# EasyEDA Pro project ProPrj_CyMouse.epro, board 无线充电接收端
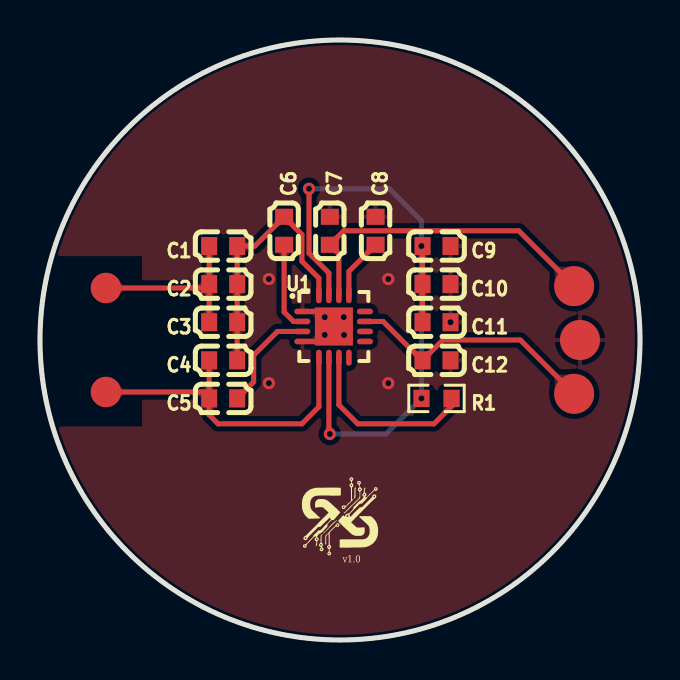
[diagram p5: board, top side]
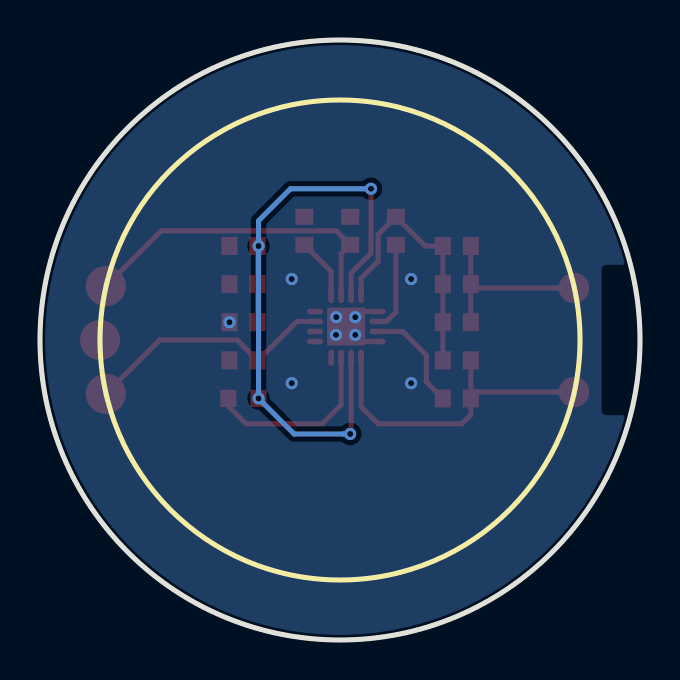
[diagram p6: board, bottom side, seen from below]

Outline 30 x 30 mm; copper layers: Top Layer, Bottom Layer. Coordinates in mm from the lower left corner of the outline.
Outline path: circle c15,15 r15
Stack: Top Layer 0.035mm / Dielectric1 1.51mm FR4 er 4.5 / Bottom Layer 0.035mm

## Design rules (mm)
template: JLCPCB Capability(Two Layers Board)
spacing copperThickness1oz (default): track to track 0.102, other pairs 0.152 to 0.3
spacing copperThickness2oz: track to track 0.203, other pairs 0.152 to 0.3
track width copperThickness1oz (default): min 0.127, default 0.254, max 2.54
track width copperThickness2oz: min 0.203, default 0.254, max 2.54
differential pair differentialPair (default): width min 0.127, default 0.254, max 2.54; gap min 0.152, default 0.152
via viaSize (default): diameter min 0.5, default 0.61, max 10; hole min 0.3, default 0.305, max 6.3

## Placement (name value [footprint] x y rotation side)
C1  10nF  [C0603]  9.16 19.7 180 top
C2  100nF  [C0603]  9.16 17.79 180 top
C3  22nF  [C0603]  9.16 15.89 180 top
C4  2.2nF  [C0603]  9.16 13.98 180 top
C5  47nF  [C0603]  9.16 12.08 180 top
C6  47nF  [C0603]  12.21 20.46 270 top
C7  4.7uF  [C0603]  14.49 20.46 90 top
C8  1uF  [C0603]  16.78 20.46 270 top
C9  10uF  [C0603]  19.83 19.7 180 top
C10  100nF  [C0603]  19.83 17.79 0 top
C11  10uF  [C0603]  19.83 15.89 180 top
C12  100nF  [C0603]  19.83 13.98 180 top
L1  -  [Test-Point-0.5mm#2]  3.3 17.6 0 top
L2  -  [Test-Point-0.5mm#2]  3.3 12.4 0 top
NOREF  -  [Pad_e63]  3.3 12.4 0 top
NOREF#2  -  [Pad_e62]  3.3 17.6 0 top
R1  220Ω  [R0603]  19.83 12.08 180 top
TP1  -  [Test-Point-0.5mm]  26.71 17.69 0 top
TP2  -  [Test-Point-0.5mm]  27 15 0 top
TP3  -  [Test-Point-0.5mm]  26.71 12.31 0 top
U1  NU1680  [QFN-16_L3.0-W3.0-P0.50-TL-EP1.9]  14.68 15.68 0 top

## Footprints (pads in the part's own frame, mm; a bottom-side part is the same pattern mirrored in y, then rotated)
C0603
  rect 0.8x0.9 smd: 1(-0.7,0) 2(0.7,0)
Pad_e62
  round 1.524 smd: 1(0,0)
Pad_e63
  round 1.524 smd: 2(0,0)
QFN-16_L3.0-W3.0-P0.50-TL-EP1.9
  oval 0.8x0.28 smd: 1(-1.565,0.749) 2(-1.565,0.249) 3(-1.565,-0.251) 4(-1.565,-0.751) 9(1.565,-0.751) 10(1.565,-0.251) 11(1.565,0.249) 12(1.565,0.749)
  oval 0.28x0.8 smd: 5(-0.739,-1.562) 6(-0.238,-1.562) 7(0.261,-1.562) 8(0.761,-1.562) 13(0.761,1.562) 14(0.261,1.562) 15(-0.238,1.562) 16(-0.739,1.562)
  rect 1.9x1.9 smd: 17(0.011,-0.001)
R0603
  rect 0.806x0.864 smd: 1(-0.753,0) 2(0.753,0)
Test-Point-0.5mm
  round 2 smd: 1(0,0)
Test-Point-0.5mm#2
  round 0.5 smd: 1(0,0)

## Nets
As in the schematic, except:
L1: C1.2 C2.2 C3.2 L1.1 NOREF#2.1
L2: C4.2 C5.2 L2.1 NOREF.2 U1.5

Pads without a net: U1 8 9 10 12

## Via types
v1: diameter 0.61, hole 0.305, Top Layer to Bottom Layer, 13 vias

## Routing (per net, layer and track width the routed paths; a pad name or vN(x,y) marks a point on that pad's centre or on a via; arc(x,y) is an arc through that point)
GND: length 1.7
  Top Layer w0.254: 13.12,14.93 13.94,14.93 ; 13.12,16.43 13.96,16.43
  vias: v1(11.44,18.05) v1(11.44,12.84) v1(14.24,16.14) v1(14.24,15.25) v1(15.19,16.14) v1(15.2,15.25) v1(17.41,18.05) v1(17.41,12.84) v1(20.53,15.89)
L1: length 9.1
  Top Layer w0.254: C1.2 C2.2 ; C2.2 C3.2 ; C2.2 8.26,17.6 L1.1
L2: length 16.5
  Top Layer w0.254: C5.2 8.46,11.25 8.9,10.81 13.09,10.81 13.94,11.66 13.94,14.11 ; C5.2 8.14,12.4 NOREF.2 ; C5.2 C4.2
VRECT: length 33.9
  Top Layer w0.254: 14.44,14.11 14.44,10.35 v1(14.49,10.3) ; 14.44,17.24 14.44,18.35 13.45,19.34 v1(13.45,22.56) ; C9.2 C10.1 C11.2
  Bottom Layer w0.254: v1(13.45,22.56) 17.47,22.56 19.07,20.96 v1(19.07,19.7) v1(19.07,12.08) 17.29,10.3 v1(14.49,10.3)
WC_OUT: length 16.4
  Top Layer w0.254: TP1.1 23.94,20.46 15.19,20.46 C7.1 14.94,19.31 U1.14
$1N1006: length 4.5
  Top Layer w0.254: C6.2 12.21,16.4 12.68,15.93 13.12,15.93
$1N1007: length 5.4
  Top Layer w0.254: 13.12,15.43 11.87,15.43 10.68,14.24 10.68,12.9 C5.1
$1N1010: length 13.3
  Top Layer w0.254: C4.1 C3.1 C2.1 C1.1 10.74,19.7 C6.1 13.09,20.27 13.09,18.94 13.94,18.09 U1.16
$1N1012: length 3.1
  Top Layer w0.254: 15.44,17.24 15.44,18.43 C8.2
$1N1018: length 9.1
  Top Layer w0.254: 14.94,14.11 14.94,11.75 15.89,10.81 19.7,10.81 20.58,11.69 R1.1
$1N1025: length 12.8
  Top Layer w0.254: TP3.1 24.02,15 20.14,15 C12.2 19.1,13.98 17.16,15.93 U1.11

## Copper pours and planes (outline as drawn; the poured copper is in the pictures)
GND on Top Layer: 30,15.37 29.96,16.1 29.89,16.84 29.78,17.56 29.64,18.29 29.46,19 29.24,19.71 28.99,20.4 28.71,21.08 28.4,21.74 28.05,22.39 27.67,23.02 27.26,23.64 26.83,24.23 26.36,24.8 25.86,25.34 25.34,25.86 24.8,26.36 24.23,26.83 23.64,27.26 23.02,27.67 22.39,28.05 21.74,28.4 21.08,28.71 20.4,28.99 19.71,29.24 19,29.46 18.29,29.64 17.56,29.78 16.84,29.89 16.1,29.96 15.37,30 14.63,30 13.9,29.96 13.16,29.89 12.44,29.78 11.71,29.64 11,29.46 10.29,29.24 9.6,28.99 8.92,28.71 8.26,28.4 7.61,28.05 6.98,27.67 6.36,27.26 5.77,26.83 5.2,26.36 4.66,25.86 4.14,25.34 3.64,24.8 3.17,24.23 2.74,23.64 2.33,23.02 1.95,22.39 1.6,21.74 1.29,21.08 1.01,20.4 0.76,19.71 0.54,19 0.36,18.29 0.22,17.56 0.11,16.84 0.04,16.1 0,15.37 0,14.63 0.04,13.9 0.11,13.16 0.22,12.44 0.36,11.71 0.54,11 0.76,10.29 1.01,9.6 1.29,8.92 1.6,8.26 1.95,7.61 2.33,6.98 2.74,6.36 3.17,5.77 3.64,5.2 4.14,4.66 4.66,4.14 5.2,3.64 5.77,3.17 6.36,2.74 6.98,2.33 7.61,1.95 8.26,1.6 8.92,1.29 9.6,1.01 10.29,0.76 11,0.54 11.71,0.36 12.44,0.22 13.16,0.11 13.9,0.04 14.63,0 15.37,0 16.1,0.04 16.84,0.11 17.56,0.22 18.29,0.36 19,0.54 19.71,0.76 20.4,1.01 21.08,1.29 21.74,1.6 22.39,1.95 23.02,2.33 23.64,2.74 24.23,3.17 24.8,3.64 25.34,4.14 25.86,4.66 26.36,5.2 26.83,5.77 27.26,6.36 27.67,6.98 28.05,7.61 28.4,8.26 28.71,8.92 28.99,9.6 29.24,10.29 29.46,11 29.64,11.71 29.78,12.44 29.89,13.16 29.96,13.9 30,14.63
GND on Bottom Layer: 30,15.37 29.96,16.1 29.89,16.84 29.78,17.56 29.64,18.29 29.46,19 29.24,19.71 28.99,20.4 28.71,21.08 28.4,21.74 28.05,22.39 27.67,23.02 27.26,23.64 26.83,24.23 26.36,24.8 25.86,25.34 25.34,25.86 24.8,26.36 24.23,26.83 23.64,27.26 23.02,27.67 22.39,28.05 21.74,28.4 21.08,28.71 20.4,28.99 19.71,29.24 19,29.46 18.29,29.64 17.56,29.78 16.84,29.89 16.1,29.96 15.37,30 14.63,30 13.9,29.96 13.16,29.89 12.44,29.78 11.71,29.64 11,29.46 10.29,29.24 9.6,28.99 8.92,28.71 8.26,28.4 7.61,28.05 6.98,27.67 6.36,27.26 5.77,26.83 5.2,26.36 4.66,25.86 4.14,25.34 3.64,24.8 3.17,24.23 2.74,23.64 2.33,23.02 1.95,22.39 1.6,21.74 1.29,21.08 1.01,20.4 0.76,19.71 0.54,19 0.36,18.29 0.22,17.56 0.11,16.84 0.04,16.1 0,15.37 0,14.63 0.04,13.9 0.11,13.16 0.22,12.44 0.36,11.71 0.54,11 0.76,10.29 1.01,9.6 1.29,8.92 1.6,8.26 1.95,7.61 2.33,6.98 2.74,6.36 3.17,5.77 3.64,5.2 4.14,4.66 4.66,4.14 5.2,3.64 5.77,3.17 6.36,2.74 6.98,2.33 7.61,1.95 8.26,1.6 8.92,1.29 9.6,1.01 10.29,0.76 11,0.54 11.71,0.36 12.44,0.22 13.16,0.11 13.9,0.04 14.63,0 15.37,0 16.1,0.04 16.84,0.11 17.56,0.22 18.29,0.36 19,0.54 19.71,0.76 20.4,1.01 21.08,1.29 21.74,1.6 22.39,1.95 23.02,2.33 23.64,2.74 24.23,3.17 24.8,3.64 25.34,4.14 25.86,4.66 26.36,5.2 26.83,5.77 27.26,6.36 27.67,6.98 28.05,7.61 28.4,8.26 28.71,8.92 28.99,9.6 29.24,10.29 29.46,11 29.64,11.71 29.78,12.44 29.89,13.16 29.96,13.9 30,14.63

Small or netless copper shapes (teardrops, artwork), in the pictures only: 44 on Top Layer, 6 on Bottom Layer

## Text on the board
Top Silkscreen Layer: v1.0
